# EAGLE schematic schematic1 (EAGLE 8.6.2)
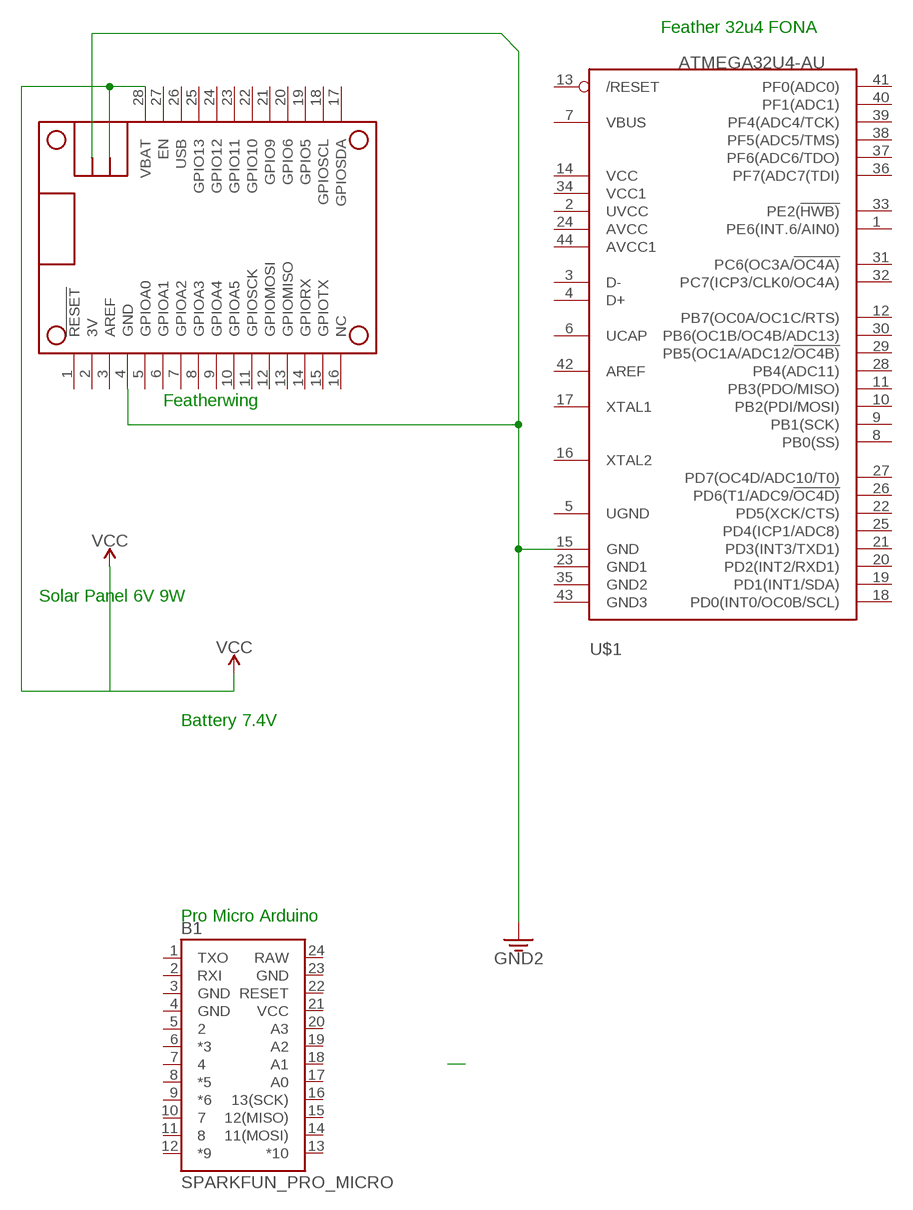
[diagram p0: schematic, sheet 1]

## Parts
B1  SPARKFUN_PRO_MICRO  [SPARKFUN_PRO_MICRO]
MS1  FEATHERWING  [FEATHERWING]
U$1  ATMEGA32U4-AU  [TQFP44]

## Nets
3.3V: MS1.4(GND) U$1.15(GND) ; supply symbol labelled GND2
VBAT: MS1.28(VBAT) ; supply symbol labelled VCC
Unconnected: B1.1(TXO) B1.2(RXI) B1.5 B1.6(*3) B1.7 B1.8(*5) B1.9(*6) B1.10 B1.11 B1.12(*9) B1.13(*10) B1.14(11(MOSI)) B1.15(12(MISO)) B1.16(13(SCK)) B1.17(A0) B1.18(A1) B1.19(A2) B1.20(A3) B1.22(RESET) MS1.1(!RESET) MS1.2(3V) MS1.3(AREF) MS1.5(GPIOA0) MS1.6(GPIOA1) MS1.7(GPIOA2) MS1.8(GPIOA3) MS1.9(GPIOA4) MS1.10(GPIOA5) MS1.11(GPIOSCK) MS1.12(GPIOMOSI) MS1.13(GPIOMISO) MS1.14(GPIORX) MS1.15(GPIOTX) MS1.16(NC) MS1.17(GPIOSDA) MS1.18(GPIOSCL) MS1.19(GPIO5) MS1.20(GPIO6) MS1.21(GPIO9) MS1.22(GPIO10) MS1.23(GPIO11) MS1.24(GPIO12) MS1.25(GPIO13) MS1.26(USB) MS1.27(EN) U$1.1(PE6(INT.6/AIN0)) U$1.2(UVCC) U$1.3(D-) U$1.4(D+) U$1.5(UGND) U$1.6(UCAP) U$1.7(VBUS) U$1.8(PB0(SS)) U$1.9(PB1(SCK)) U$1.10(PB2(PDI/MOSI)) U$1.11(PB3(PDO/MISO)) U$1.12(PB7(OC0A/OC1C/RTS)) U$1.13(/RESET) U$1.14(VCC) U$1.16(XTAL2) U$1.17(XTAL1) U$1.18(PD0(INT0/OC0B/SCL)) U$1.19(PD1(INT1/SDA)) U$1.20(PD2(INT2/RXD1)) U$1.21(PD3(INT3/TXD1)) U$1.22(PD5(XCK/CTS)) U$1.23(GND1) U$1.24(AVCC) U$1.25(PD4(ICP1/ADC8)) U$1.26(PD6(T1/ADC9/!OC4D)) U$1.27(PD7(OC4D/ADC10/T0)) U$1.28(PB4(ADC11)) U$1.29(PB5(OC1A/ADC12/!OC4B)) U$1.30(PB6(OC1B/OC4B/ADC13)) U$1.31(PC6(OC3A/!OC4A)) U$1.32(PC7(ICP3/CLK0/OC4A)) U$1.33(PE2(!HWB)) U$1.34(VCC1) U$1.35(GND2) U$1.36(PF7(ADC7(TDI)) U$1.37(PF6(ADC6/TDO)) U$1.38(PF5(ADC5/TMS)) U$1.39(PF4(ADC4/TCK)) U$1.40(PF1(ADC1)) U$1.41(PF0(ADC0)) U$1.42(AREF) U$1.43(GND3) U$1.44(AVCC1)

## Notes on the sheet
- Feather 32u4 FONA
- Featherwing
- Solar Panel 6V 9W
- Battery 7.4V
- Pro Micro Arduino

## Power pins joined to a net without a drawn wire
3V: B1.21(VCC)
GND: B1.3(GND) B1.4(GND) B1.23(GND)
RAW: B1.24(RAW)

## Library data of the parts
B1 = SparkFun-Boards:SPARKFUN_PRO_MICRO: SparkFun Pro Micro Atmega32U4 compatible footprint. SparkFun Products: 3.3V/8MHz <https://www.sparkfun.com/products/12587> 5V/16MHz <https://www.sparkfun.com/products/12640>
MS1 = adafruit:FEATHERWING
U$1 = adafruit:ATMEGA32U4: http://www.ladyada.net/library/eagle